# EAGLE design droneSlave (EAGLE 9.0.0)
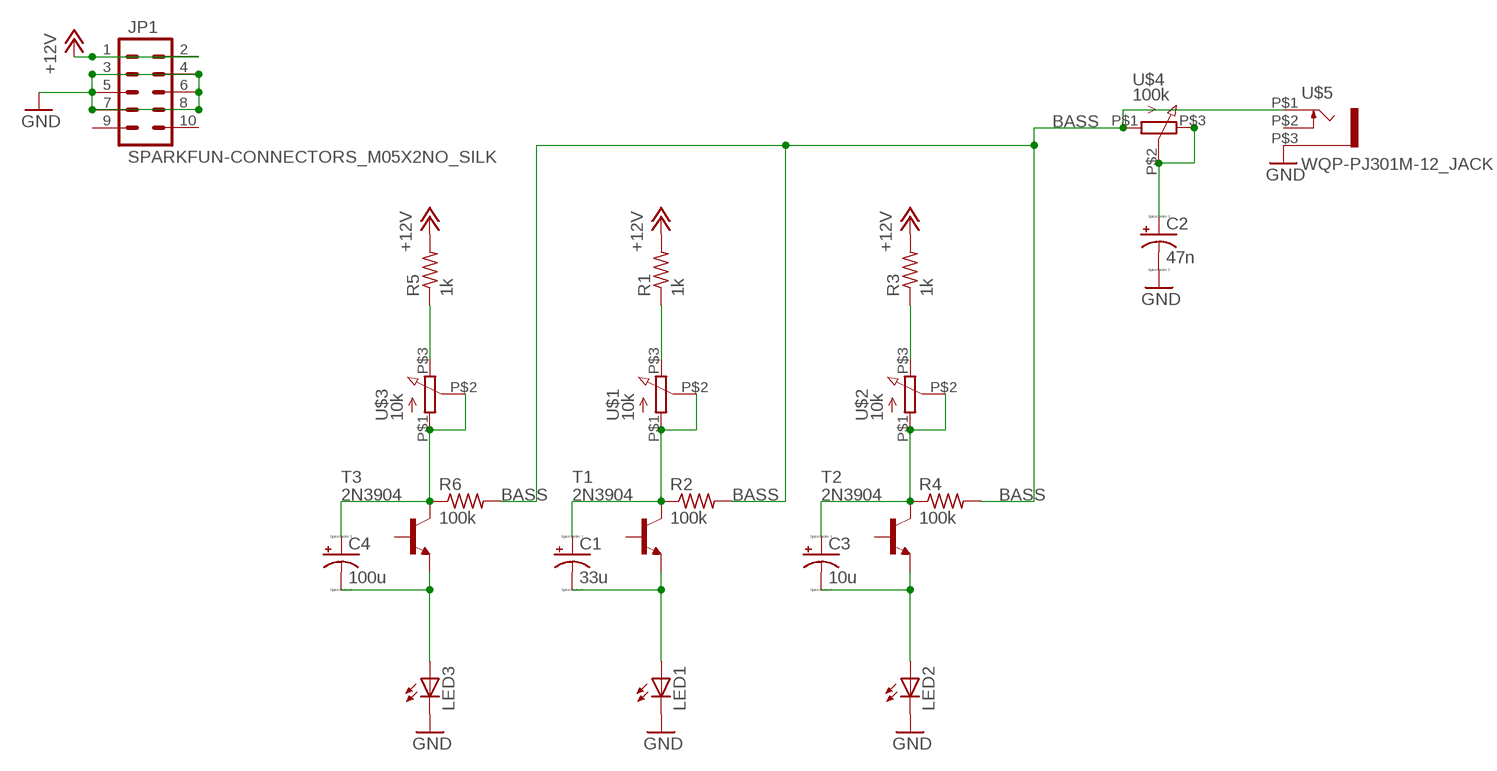
[diagram p0: schematic, sheet 1]

## Parts
C1  33u  CPOL-USE2.5-7  [E2,5-7]
C2  47n  CPOL-USE2.5-7  [E2,5-7]
C3  10u  CPOL-USE2.5-7  [E2,5-7]
C4  100u  CPOL-USE2.5-7  [E2,5-7]
JP1  SPARKFUN-CONNECTORS_M05X2NO_SILK  [SPARKFUN-CONNECTORS_2X5_NOSILK]
LED1  LED5MM  [LED5MM]
LED2  LED5MM  [LED5MM]
LED3  LED5MM  [LED5MM]
R1  1k  R-US_0204/7  [0204/7]
R2  100k  R-US_0204/7  [0204/7]
R3  1k  R-US_0204/7  [0204/7]
R4  100k  R-US_0204/7  [0204/7]
R5  1k  R-US_0204/7  [0204/7]
R6  100k  R-US_0204/7  [0204/7]
T1  2N3904  [TO92]
T2  2N3904  [TO92]
T3  2N3904  [TO92]
U$1  10k  INSTRUO_Q-POT  [INSTRUO_Q-POT]
U$2  10k  INSTRUO_Q-POT  [INSTRUO_Q-POT]
U$3  10k  INSTRUO_Q-POT  [INSTRUO_Q-POT]
U$4  100k  INSTRUO_Q-POT  [INSTRUO_Q-POT]
U$5  WQP-PJ301M-12_JACK  [WQP-PJ301M-12_JACK]

## Nets
+12V: JP1.1 JP1.2 R1.2 R3.2 R5.2
BASS: R2.2 R4.2 R6.2 U$4.P$1 U$5.P$1
GND: C2.- JP1.3 JP1.4 JP1.5 JP1.6 JP1.7 JP1.8 LED1.K(C) LED2.K(C) LED3.K(C) U$5.P$3
N$1: R1.1 U$1.P$3
N$2: C1.+ R2.1 T1.1(C) U$1.P$1 U$1.P$2
N$3: C1.- LED1.A T1.3(E)
N$5: R3.1 U$2.P$3
N$6: C3.+ R4.1 T2.1(C) U$2.P$1 U$2.P$2
N$7: C3.- LED2.A T2.3(E)
N$8: R5.1 U$3.P$3
N$9: C4.+ R6.1 T3.1(C) U$3.P$1 U$3.P$2
N$10: C4.- LED3.A T3.3(E)
N$12: C2.+ U$4.P$2 U$4.P$3
Unconnected: JP1.9 JP1.10 T1.2(B) T2.2(B) T3.2(B) U$5.P$2

## Library data of the parts
C1-C4 = resistor:CPOL-US: POLARIZED CAPACITOR, American symbol
JP1 = Pure_VCO_SMD_V2_2:SPARKFUN-CONNECTORS_M05X2: Header 5x2 Standard 10-pin dual row 0.1" header. Commonly used with AVR-ISP. Use with Spark Fun Electronics SKU: PRT-00778
LED1-LED3 = led:LED: LED OSRAM: - CHIPLED LG R971, LG N971, LY N971, LG Q971, LY Q971, LO R971, LY R971 LH N974, LH R974 LS Q976, LO Q976, LY Q976 LO Q996 - Hyper CHIPLED LW Q18S LB Q993, LB Q99A, LB R99A - SideLED LS A670, LO A670, LY A670, LG A670, LP A670 LB A673, LV A673, LT A673, LW A673 LH A674 LY A675 LS A676, LA A676, LO A676, LY A676, LW A676 LS A679, LY A679, LG A679 - Hyper Micro SIDELED® LS Y876, LA Y876, LO Y876, LY Y876 LT Y87S - SmartLED LW L88C, LW L88S LB L89C, LB L89S, LG L890 LS L89K, LO L89K, LY L89K LS L896, LA L896, LO L896, LY L896 - TOPLED LS T670, LO T670, LY T670, LG T670, LP T670 LSG T670, LSP T670, LSY T670, LOP T670, LYG T670 LG T671, LOG T671, LSG T671 LB T673, LV T673, LT T673, LW T673 LH T674 LS T676, LA T676, LO T676, LY T676, LB T676, LH T676, LSB T676, LW T676 LB T67C, LV T67C, LT T67C, LS T67K, LO T67K, LY T67K, LW E67C LS E67B, LA E67B, LO E67B, LY E67B, LB E67C, LV E67C, LT E67C LW T67C LS T679, LY T679, LG T679 LS T770, LO T770, LY T770, LG T770, LP T770 LB T773, LV T773, LT T773, LW T773 LH T774 LS E675, LA E675, LY E675, LS T675 LS T776, LA T776, LO T776, LY T776, LB T776 LHGB T686 LT T68C, LB T68C - Hyper Mini TOPLED® LB M676 - Mini TOPLED Santana® LG M470 LS M47K, LO M47K, LY M47K Source: http://www.osram.convergy.de LUXEON: - LUMILED® LXK2-PW12-R00, LXK2-PW12-S00, LXK2-PW14-U00, LXK2-PW14-V00 LXK2-PM12-R00, LXK2-PM12-S00, LXK2-PM14-U00 LXK2-PE12-Q00, LXK2-PE12-R00, LXK2-PE12-S00, LXK2-PE14-T00, LXK2-PE14-U00 LXK2-PB12-K00, LXK2-PB12-L00, LXK2-PB12-M00, LXK2-PB14-N00, LXK2-PB14-P00, LXK2-PB14-Q00 LXK2-PR12-L00, LXK2-PR12-M00, LXK2-PR14-Q00, LXK2-PR14-R00 LXK2-PD12-Q00, LXK2-PD12-R00, LXK2-PD12-S00 LXK2-PH12-R00, LXK2-PH12-S00 LXK2-PL12-P00, LXK2-PL12-Q00, LXK2-PL12-R00 Source: www.luxeon.com KINGBRIGHT: KA-3528ASYC Source: www.kingbright.com
R1-R6 = resistor:R-US_: RESISTOR, American symbol
T1-T3 = transistor:2N3904: NPN TRANSISTOR
U$1-U$4 = Pure_VCO_SMD_V2_2:INSTRUO_Q-POT
U$5 = thonkiconn:WQP-PJ301M-12_JACK

## Board
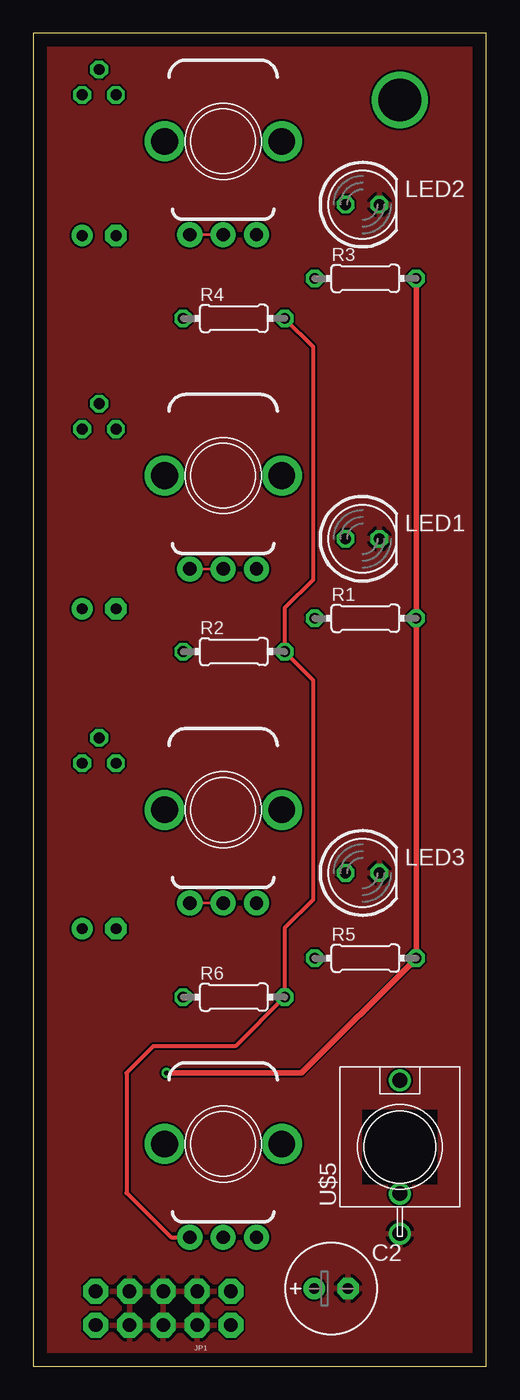
[diagram p1: board, top side]
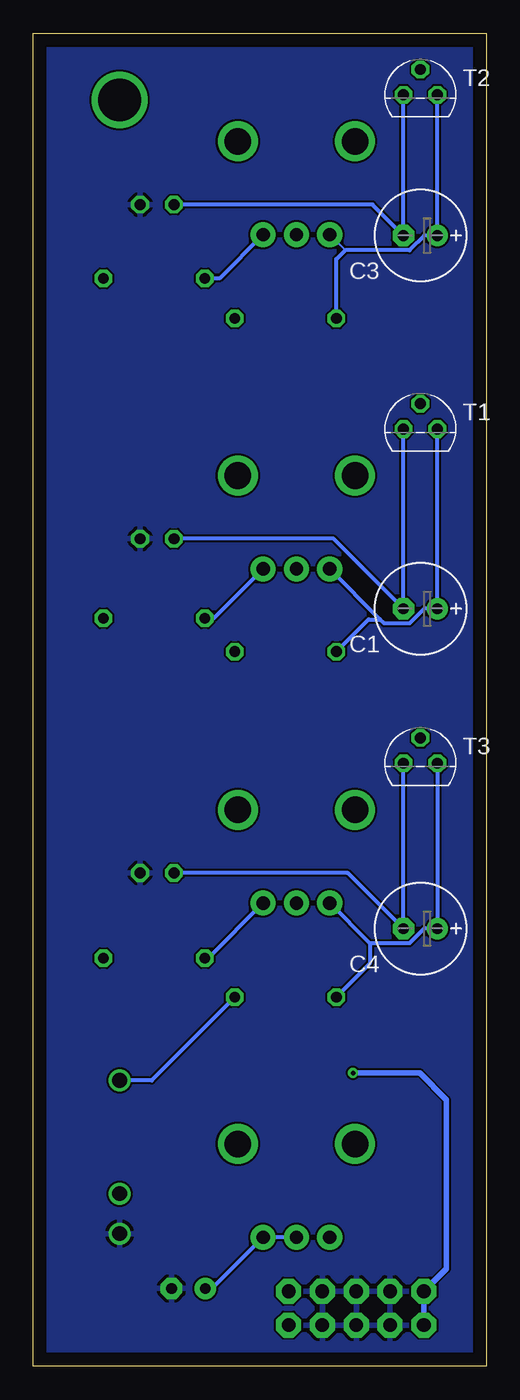
[diagram p2: board, bottom side, seen from below]

Size 34 x 100 mm. Coordinates in mm from the lower left corner, seen from the top.
Outline: 0,0 34,0 34,100 0,100 0,0
Copper layers (1*16): Top 0.035mm / dielectric 1.5mm / Bottom 0.035mm
Design rules "default": minimum track width 6mil, minimum drill 0.35mm, track to track 6mil, track to pad 6mil, pad to pad 6mil, via to via 6mil, smd to smd 6mil, copper to edge 40mil, drill to drill 6mil, minimum pad ring 10mil, minimum via ring 8mil, stop-mask expansion 4mil, vias tented up to drill 0mil, thermal gap 10mil

### Footprints (pad centres in the part's own frame; a part is rotated, then mirrored left to right if it is on the bottom)
E2,5-7 = drill 0.813 pad 1.6: + -1.27,0 | drill 0.813 pad 1.6 octagon: - 1.27,0
SPARKFUN-CONNECTORS_2X5_NOSILK = drill 1.016 pad 1.88 octagon: 1 -1.27,5.08; 2 1.27,5.08; 3 -1.27,2.54; 4 1.27,2.54; 5 -1.27,0; 6 1.27,0; 7 -1.27,-2.54; 8 1.27,-2.54; 9 -1.27,-5.08; 10 1.27,-5.08
LED5MM = drill 0.813 octagon: A -1.27,0; K 1.27,0
0204/7 = drill 0.813 octagon: 1 -3.81,0; 2 3.81,0
TO92 = drill 0.813 octagon: 1 1.27,0; 2 0,1.905; 3 -1.27,0
INSTRUO_Q-POT = drill 1 pad 1.88: P$1 -2.5,-7; P$2 0,-7; P$3 2.5,-7 | drill 2 pad 2.68: P$4 -4.4,0; P$5 4.4,0
WQP-PJ301M-12_JACK = drill 1.1: P$1 0,5; P$2 0,-3.5; P$3 0,-6.5

### Placement (x,y rotation side)
C1  4.94,56.83 180 bottom
C2  22.36,5.83 0 top
C3  4.94,84.83 180 bottom
C4  4.94,32.83 180 bottom
JP1  9.76,4.35 90 top
LED1  24.71,62.08 0 top
LED2  24.71,87.15 0 top
LED3  24.71,37 0 top
R1  24.93,56.11 0 top
R2  15.06,53.61 0 top
R3  24.93,81.61 0 top
R4  15.06,78.61 0 top
R5  24.93,30.61 0 top
R6  15.06,27.69 0 top
T1  4.94,70.31 0 bottom
T2  4.94,95.38 0 bottom
T3  4.94,45.24 0 bottom
U$1  14.25,66.82 0 top
U$2  14.25,91.89 0 top
U$3  14.25,41.74 0 top
U$4  14.25,16.67 0 top
U$5  27.52,16.44 0 top

### Tracks (layer width: path | path; a pad name or v marks a point on that pad's centre or on a via)
+12V  (via drill 0.35)
  Top 0.406: R3.2 R1.2 R5.2 20.13,22 v10,22
  Bottom 0.406: v10,22 5,22 3,20 3,7.3 JP1.2 JP1.1
BASS
  Top 0.305: R4.2 21,76.48 21,59 18.87,56.87 R2.2 21,51.48 21,35 18.87,32.87 R6.2 15.18,24 9,24 7,22 7,13 10.33,9.67 U$4.P$1
  Bottom 0.305: R6.2 25.12,21.44 U$5.P$1
GND
  pour Bottom: 0,100 34,100 34,0 0,0
  pour Top: 0,100 34,100 34,0 0,0
N$1
  Bottom 0.305: U$1.P$3 20.46,56.11 R1.1
N$2
  Top 0.203: U$1.P$1 U$1.P$2
  Bottom 0.305: T1.1 C1.+ 4.65,56.83 5.75,55.73 7.66,55.73 7.97,56.03 | T1.1 | 7.97,56.03 U$1.P$1 | R2.1 8.83,56.03 7.97,56.03
N$3
  Bottom 0.305: T1.3 C1.- 11.46,62.08 LED1.A | T1.3
N$4  (via drill 3.2)
  other vias: 27.52,95
N$5
  Bottom 0.305: U$2.P$3 20.03,81.61 R3.1
N$6
  Top 0.203: U$2.P$1 U$2.P$2
  Bottom 0.203: 10.59,83.72 U$2.P$1
  Bottom 0.305: T2.1 C3.+ 4.65,84.83 5.75,83.72 10.59,83.72 11.25,83.06 R4.1 | T2.1
N$7
  Bottom 0.305: T2.3 C3.- 8.53,87.15 LED2.A | T2.3
N$8
  Bottom 0.305: U$3.P$3 20.88,30.61 R5.1
N$9
  Top 0.203: U$3.P$1 U$3.P$2
  Bottom 0.305: T3.1 C4.+ | C4.+ | C4.+ 4.65,32.83 5.75,31.73 8.73,31.73 | 8.73,31.73 U$3.P$1 | 8.73,31.73 8.73,30.21 R6.1
N$10
  Bottom 0.305: T3.3 C4.- 10.38,37 LED3.A | T3.3
N$12
  Bottom 0.305: U$4.P$2 U$4.P$3 20.59,5.83 C2.+